# Altium schematic sheet Micro_Controller.SchDoc
size A
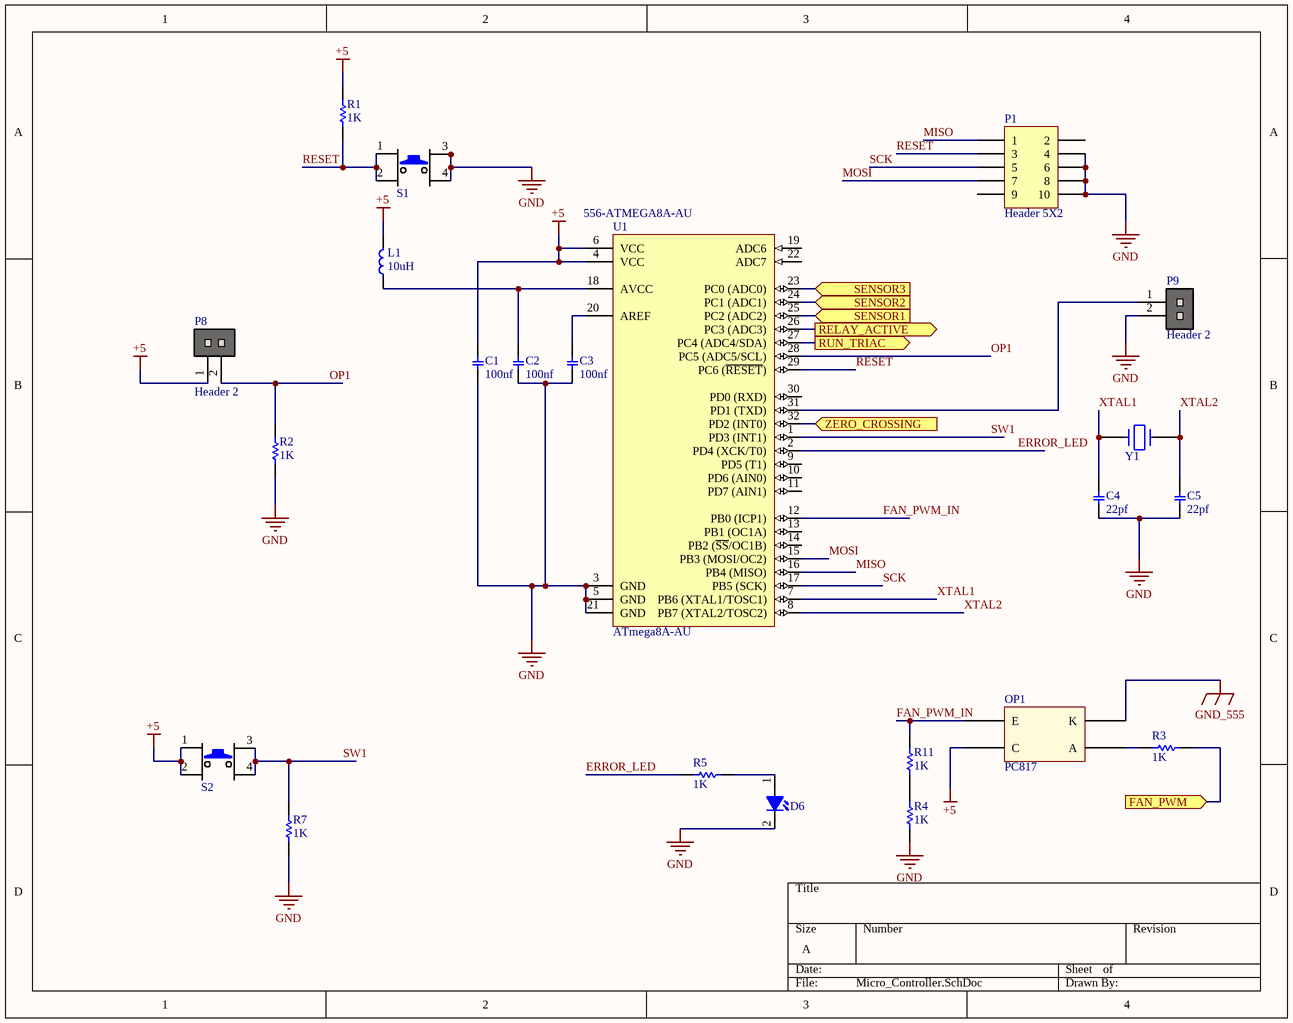
[diagram p0: Micro_Controller.SchDoc]

## Parts
C1  value 100nf  [C1206]  (hidden comment: Capacitor C SMD 1206)
C2  value 100nf  [C1206]  (hidden comment: Capacitor C SMD 1206)
C3  value 100nf  [C1206]  (hidden comment: Capacitor C SMD 1206)
C4  value 22pf  [C1206]  (hidden comment: Capacitor C SMD 1206)
C5  value 22pf  [C1206]  (hidden comment: Capacitor C SMD 1206)
D6  LED THD 3mm  [LED THD 3mm (Green)]  (value not drawn)
L1  value 10uH  [L1206]  (hidden comment: Inductor SMD NC 1206)
OP1  PC817  [PC817 SMD]
P1  Header 5X2  [HDR2X5]
P8  Header 2  [HDR 1X2]
P9  Header 2  [HDR 1X2]
R1  value 1K  [SMD-1206-RES]  (hidden comment: Resistor SMD 1206)
R2  value 1K  [SMD-1206-RES]  (hidden comment: Resistor SMD 1206)
R3  value 1K  [SMD-1206-RES]  (hidden comment: Resistor SMD 1206)
R4  value 1K  [SMD-1206-RES]  (hidden comment: Resistor SMD 1206)
R5  value 1K  [SMD-1206-RES]  (hidden comment: Resistor SMD 1206)
R7  value 1K  [SMD-1206-RES]  (hidden comment: Resistor SMD 1206)
R11  value 1K  [SMD-1206-RES]  (hidden comment: Resistor SMD 1206)
S1  SW_PB4 THD  [SW THD 4 PIN (6)]  (value not drawn)
S2  SW_PB4 THD  [SW THD 4 PIN (6)]  (value not drawn)
U1  ATmega8A-AU  Supplier Part Number 1: 556-ATMEGA8A-AU  [32A_N]
Y1  Crystal  [Crystal 5 16MHZ]  (value not drawn)

## Ports
FAN_PWM (in), RELAY_ACTIVE (out), RUN_TRIAC (out), SENSOR1 (in), SENSOR2 (in), SENSOR3 (in), ZERO_CROSSING (in)

## Nets
+5: C1.2 L1.2 OP1.4(C) P8.1 R1.2 S2.1 S2.2 U1.4(VCC) U1.6(VCC)
GND: C1.1 C2.1 C3.1 C4.1 C5.1 D6.2(CATHODE) P1.4 P1.6 P1.8 P1.10 P9.2 R2.1 R4.1 R7.1 S1.3 S1.4 U1.3(GND) U1.5(GND) U1.21(GND)
GND_555: OP1.2(K)
ERROR_LED: R5.1 U1.2(PD4_(XCK/T0))
FAN_PWM: R3.2 ; port FAN_PWM
FAN_PWM_IN: OP1.3(E) R11.2 U1.12(PB0_(ICP1))
MISO: P1.1 U1.16(PB4_(MISO))
MOSI: P1.7 U1.15(PB3_(MOSI/OC2))
OP1: P8.2 R2.2 U1.28(PC5_(ADC5/SCL))
RELAY_ACTIVE: U1.26(PC3_(ADC3)) ; port RELAY_ACTIVE
RESET: P1.3 R1.1 S1.1 S1.2 U1.29(PC6_(~{RESET}))
RUN_TRIAC: U1.27(PC4_(ADC4/SDA)) ; port RUN_TRIAC
SCK: P1.5 U1.17(PB5_(SCK))
SENSOR1: U1.25(PC2_(ADC2)) ; port SENSOR1
SENSOR2: U1.24(PC1_(ADC1)) ; port SENSOR2
SENSOR3: U1.23(PC0_(ADC0)) ; port SENSOR3
SW1: R7.2 S2.3 S2.4 U1.1(PD3_(INT1))
XTAL1: C4.2 U1.7(PB6_(XTAL1/TOSC1)) Y1.1
XTAL2: C5.2 U1.8(PB7_(XTAL2/TOSC2)) Y1.2
ZERO_CROSSING: U1.32(PD2_(INT0)) ; port ZERO_CROSSING
NetC2_2: C2.2 L1.1 U1.18(AVCC)
NetC3_2: C3.2 U1.20(AREF)
NetD6_1: D6.1(ANODE) R5.2
NetOP1_1: OP1.1(A) R3.1
NetP9_1: P9.1 U1.31(PD1_(TXD))
NetR4_2: R4.2 R11.1

Not connected (* = marked no-connect by the designer): P1 2 9; U1 9(PD5_(T1)) 10(PD6_(AIN0)) 11(PD7_(AIN1)) 13(PB1_(OC1A)) 14(PB2_(~{SS}/OC1B)) 19(ADC6) 22(ADC7) 30(PD0_(RXD))

## Library data of the parts
OP1 = PC817: PC817 optocpler; ComponentLink2Description: Website Smart World; ComponentLink2URL: https://www.smartw.ir/; ComponentLink3Description: Telegram; ComponentLink3URL: https://t.me/altium_smartw; ComponentLink4Description: Instagram; ComponentLink4URL: https://Instagram.com/smartgw.ir; DatasheetVersion: 2021
P1 = Header 5X2: Header, 5-Pin, Dual row; LatestRevisionDate: 17-Jul-2002; LatestRevisionNote: Re-released for DXP Platform.; Publisher: Altium Limited
P8 P9 = Header 2: Header, 2-Pin; ComponentLinkp-URL: https://www.smartw.ir/; DatasheetVersion: 2020
U1 = ATmega8A-AU: 8-bit AVR Microcontroller, 8KB Flash, 512 Bytes EEPROM, 1KB SRAM, 32-pin TQFP, Industrial Grade (-40°C to 85°C); ComponentLink1Description: Website Smart World; ComponentLink1URL: https://www.smartw.ir/; Supplier 1: Mouser
C1-C5 = Capacitor C SMD 1206: DatasheetVersion: 2021; ComponentLink1Description: Website Smart World; ComponentLink1URL: https://www.smartw.ir/; ComponentLink2Description: Telegram; ComponentLink2URL: https://t.me/altium_smartw; ComponentLink3Description: Instagram; ComponentLink3URL: https://Instagram.com/smartgw.ir
D6 = LED THD 3mm: ComponentLink1Description: Website Smart World; ComponentLink1URL: https://www.smartw.ir/; ComponentLink2Description: Telegram; ComponentLink2URL: https://t.me/altium_smartw; ComponentLink3Description: Instagram; ComponentLink3URL: https://Instagram.com/smartgw.ir; DatasheetVersion: 2021
L1 = Inductor SMD NC 1206: DatasheetVersion: 2021; ComponentLink1Description: Website Smart World; ComponentLink1URL: https://www.smartw.ir/; ComponentLink2Description: Telegram; ComponentLink2URL: https://t.me/altium_smartw; ComponentLink3Description: Instagram; ComponentLink3URL: https://Instagram.com/smartgw.ir
R1-R5 R7 R11 = Resistor SMD 1206: DatasheetVersion: 2021; ComponentLink1Description: Website Smart World; ComponentLink1URL: https://www.smartw.ir/; ComponentLink2Description: Telegram; ComponentLink2URL: https://t.me/altium_smartw; ComponentLink3Description: Instagram; ComponentLink3URL: https://Instagram.com/smartgw.ir
S1 S2 = SW_PB4 THD: ComponentLink1Description: Website Smart World; ComponentLink1URL: https://www.smartw.ir/; ComponentLink2Description: Telegram; ComponentLink2URL: https://t.me/altium_smartw; ComponentLink3Description: Instagram; ComponentLink3URL: https://Instagram.com/smartgw.ir; DatasheetVersion: 2021
Y1 = Crystal: ComponentLink1Description: Website Smart World; ComponentLink1URL: https://www.smartw.ir/; ComponentLink2Description: Telegram; ComponentLink2URL: https://t.me/altium_smartw; ComponentLink3Description: Instagram; ComponentLink3URL: https://Instagram.com/smartgw.ir; DatasheetVersion: 2021